# EAGLE design fsr_endstop (EAGLE 6.4)
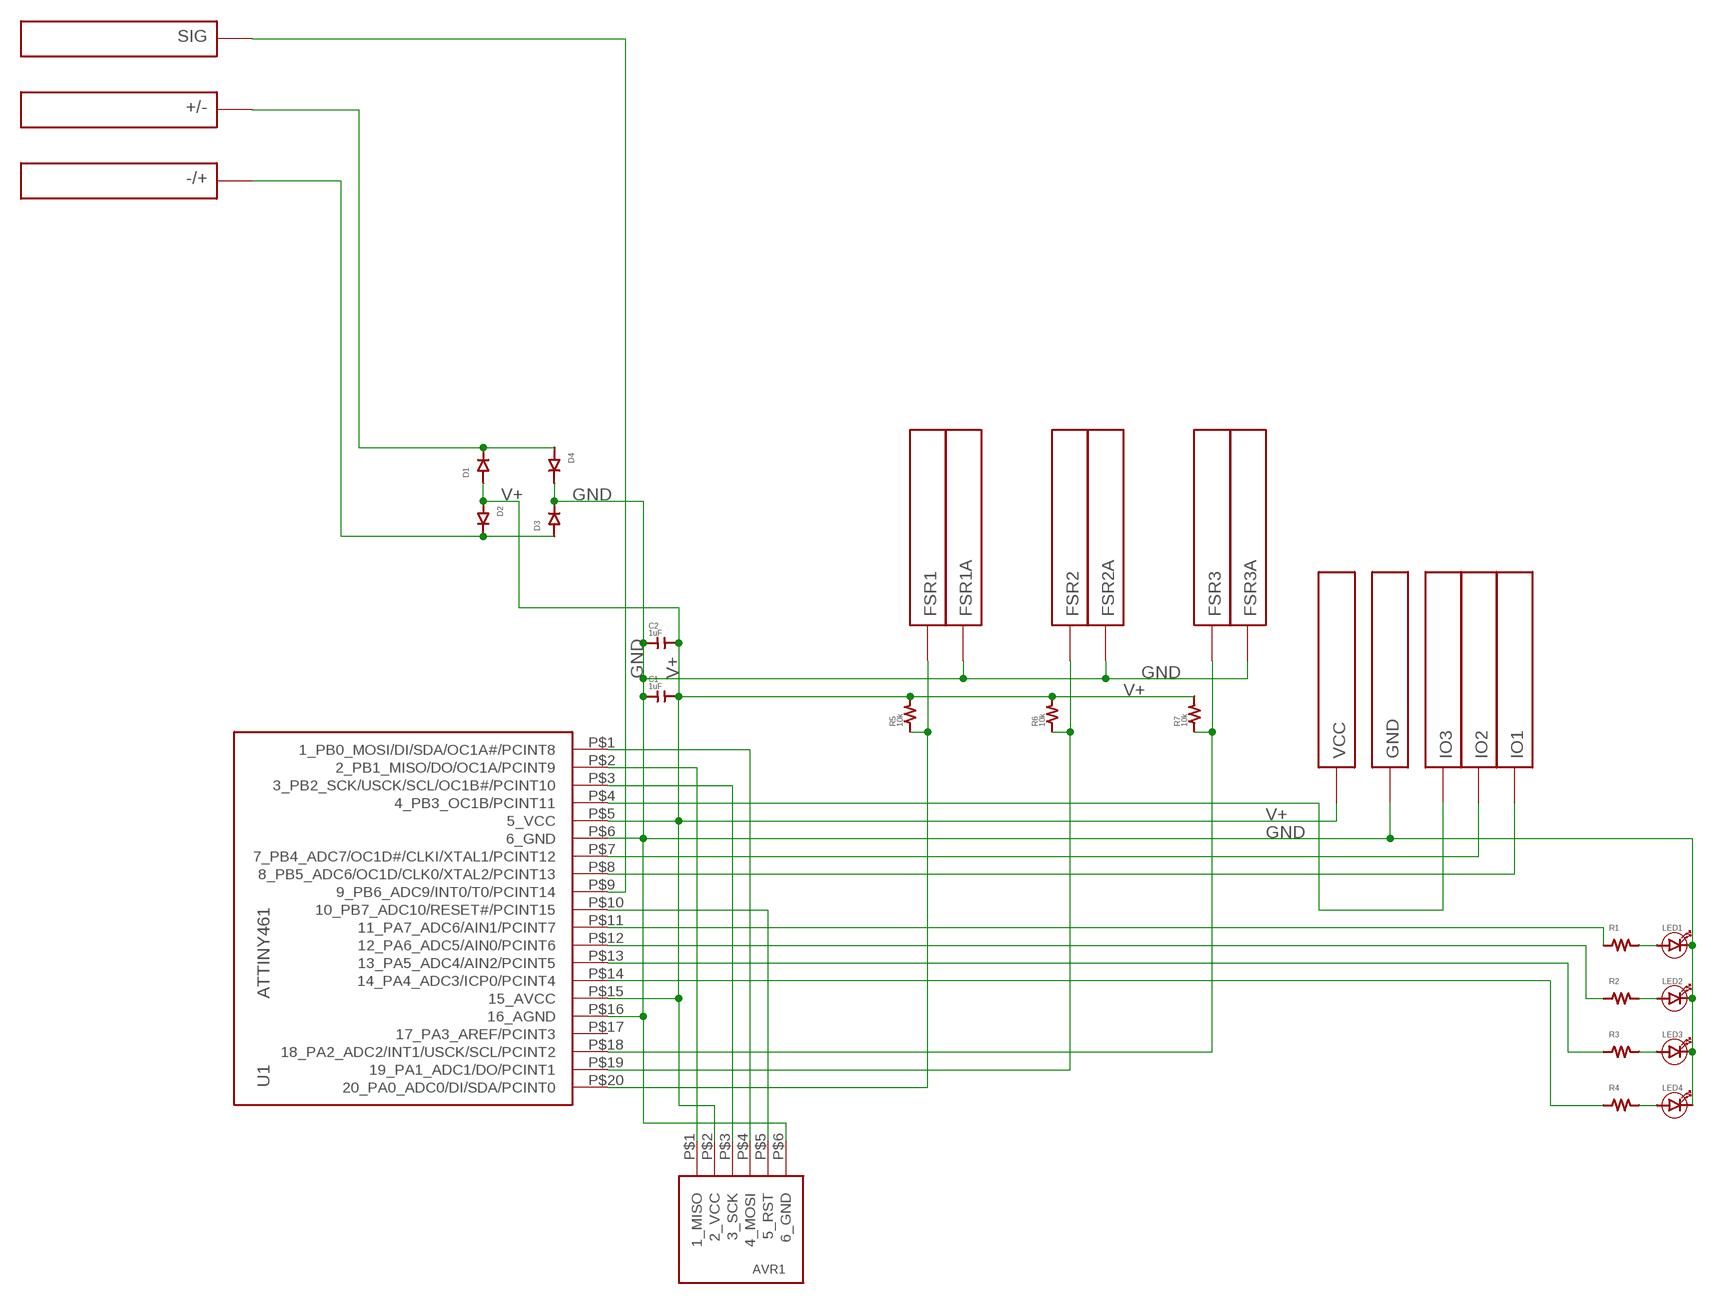
[diagram p0: schematic, sheet 1]

## Parts
+/-  PIN1.2MM  [PIN_1.2MM]
-/+  PIN1.2MM  [PIN_1.2MM]
AVR1  AVR6  [AVR6]
C1  1uF  CAP0603  [0603]
C2  1uF  CAP0603  [0603]
D1  DIODE0603  [0603_DIODE]
D2  DIODE0603  [0603_DIODE]
D3  DIODE0603  [0603_DIODE]
D4  DIODE0603  [0603_DIODE]
FSR1  PIN1.2MM  [PIN_1.2MM]
FSR1A  PIN1.2MM  [PIN_1.2MM]
FSR2  PIN1.2MM  [PIN_1.2MM]
FSR2A  PIN1.2MM  [PIN_1.2MM]
FSR3  PIN1.2MM  [PIN_1.2MM]
FSR3A  PIN1.2MM  [PIN_1.2MM]
GND  PIN1.2MM  [PIN_1.2MM]
IO1  PIN1.2MM  [PIN_1.2MM]
IO2  PIN1.2MM  [PIN_1.2MM]
IO3  PIN1.2MM  [PIN_1.2MM]
LED1  LED0603  [0603_DIODE]
LED2  LED0603  [0603_DIODE]
LED3  LED0603  [0603_DIODE]
LED4  LED0603  [0603_DIODE]
R1  RES0603  [0603]
R2  RES0603  [0603]
R3  RES0603  [0603]
R4  RES0603  [0603]
R5  10k  RES0603  [0603]
R6  10k  RES0603  [0603]
R7  10k  RES0603  [0603]
SIG  PIN1.2MM  [PIN_1.2MM]
U1  ATTINY461  [SOIC-20]
VCC  PIN1.2MM  [PIN_1.2MM]

## Nets
GND: AVR1.P$6(6_GND) C1.1 C2.1 D3.- D4.- FSR1A.P$1 FSR2A.P$1 FSR3A.P$1 GND.P$1 LED1.- LED2.- LED3.- LED4.- U1.P$6(6_GND) U1.P$16(16_AGND)
N$1: AVR1.P$4(4_MOSI) U1.P$1(1_PB0_MOSI/DI/SDA/OC1A#/PCINT8)
N$2: AVR1.P$1(1_MISO) U1.P$2(2_PB1_MISO/DO/OC1A/PCINT9)
N$3: -/+.P$1 D2.- D3.+
N$4: +/-.P$1 D1.- D4.+
N$5: AVR1.P$3(3_SCK) U1.P$3(3_PB2_SCK/USCK/SCL/OC1B#/PCINT10)
N$6: AVR1.P$5(5_RST) U1.P$10(10_PB7_ADC10/RESET#/PCINT15)
N$7: FSR1.P$1 R5.1 U1.P$20(20_PA0_ADC0/DI/SDA/PCINT0)
N$8: FSR2.P$1 R6.1 U1.P$19(19_PA1_ADC1/DO/PCINT1)
N$9: FSR3.P$1 R7.1 U1.P$18(18_PA2_ADC2/INT1/USCK/SCL/PCINT2)
N$10: R4.1 U1.P$14(14_PA4_ADC3/ICP0/PCINT4)
N$11: R3.1 U1.P$13(13_PA5_ADC4/AIN2/PCINT5)
N$12: R2.1 U1.P$12(12_PA6_ADC5/AIN0/PCINT6)
N$13: R1.1 U1.P$11(11_PA7_ADC6/AIN1/PCINT7)
N$14: SIG.P$1 U1.P$9(9_PB6_ADC9/INT0/T0/PCINT14)
N$15: IO3.P$1 U1.P$4(4_PB3_OC1B/PCINT11)
N$16: IO1.P$1 U1.P$8(8_PB5_ADC6/OC1D/CLK0/XTAL2/PCINT13)
N$17: IO2.P$1 U1.P$7(7_PB4_ADC7/OC1D#/CLKI/XTAL1/PCINT12)
N$18: LED1.+ R1.2
N$19: LED2.+ R2.2
N$20: LED3.+ R3.2
N$21: LED4.+ R4.2
V+: AVR1.P$2(2_VCC) C1.2 C2.2 D1.+ D2.+ R5.2 R6.2 R7.2 U1.P$5(5_VCC) U1.P$15(15_AVCC) VCC.P$1
Unconnected: U1.P$17(17_PA3_AREF/PCINT3)

## Library data of the parts
+/- -/+ FSR1 FSR1A FSR2 FSR2A FSR3 FSR3A GND IO1-IO3 SIG VCC = _sg_lib:PIN
AVR1 = _sg_misc:AVR6
C1 C2 = _sg_lib:CAP0603
D1-D4 = _sg_lib:DIODE0603
LED1-LED4 = _sg_lib:LED0603
R1-R7 = _sg_lib:RES0603
U1 = _sg_misc:ATTINY461

## Board
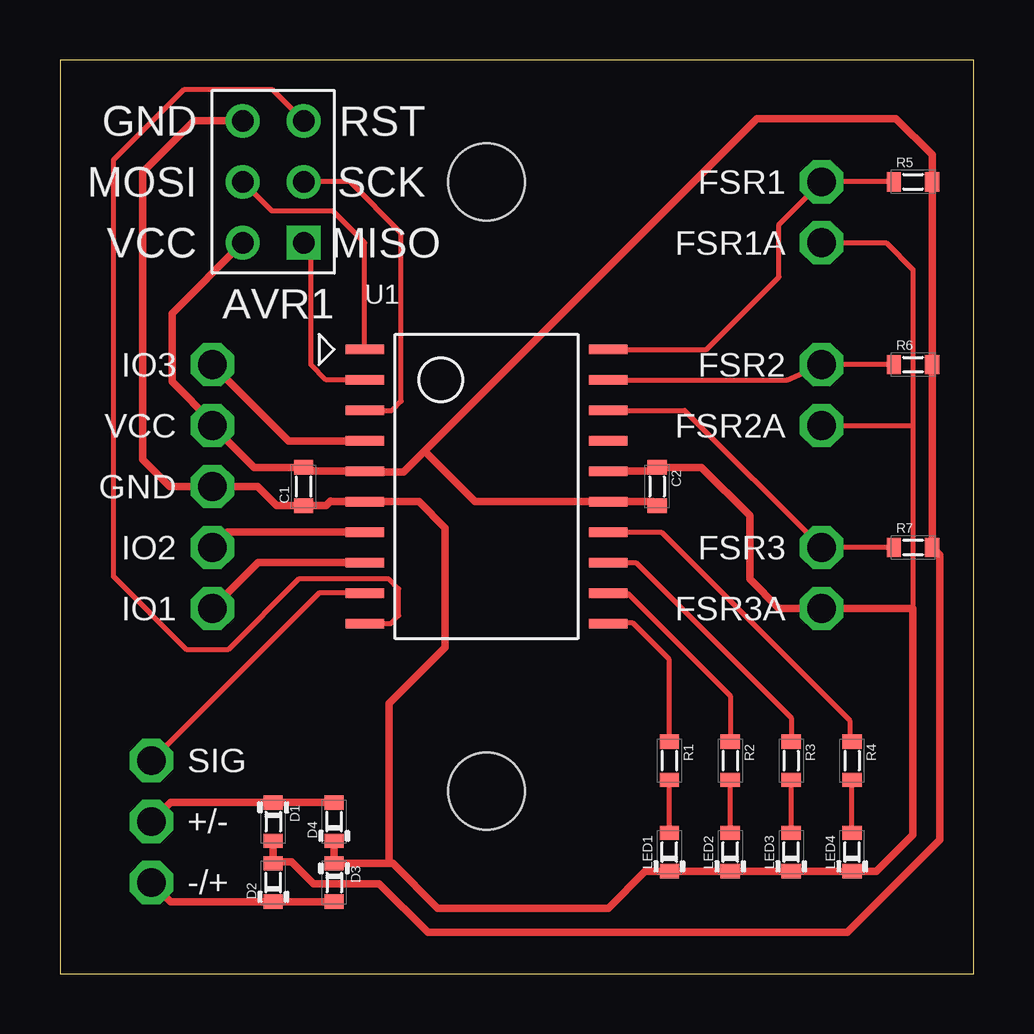
[diagram p1: board, top side]

Size 38.1 x 38.1 mm. Coordinates in mm from the lower left corner, seen from the top.
Outline: 0,0 38.1,0 38.1,38.1 0,38.1 0,0
Copper layers (1*16): Top 0.035mm / dielectric 1.5mm / Bottom 0.035mm
Design rules "default": minimum track width 10mil, minimum drill 24mil, track to track 8mil, track to pad 8mil, pad to pad 8mil, via to via 8mil, smd to smd 8mil, copper to edge 40mil, drill to drill 8mil, minimum pad ring 10mil, minimum via ring 8mil, stop-mask expansion 4mil, vias tented up to drill 0mil, thermal gap 10mil
Holes 3.2 mm at 17.78,33.02 17.78,7.62

### Footprints (pad centres in the part's own frame; a part is rotated, then mirrored left to right if it is on the bottom)
PIN_1.2MM = drill 1.2 octagon: P$1 0,0
AVR6 = drill 0.9 square: P$1 -1.27,2.54 | drill 0.9: P$2 1.27,2.54; P$3 -1.27,0; P$4 1.27,0; P$5 -1.27,-2.54; P$6 1.27,-2.54
0603 = smd 0.6 x 0.8: 1 -0.8,0; 2 0.8,0
0603_DIODE = smd 0.6 x 0.8: + 0.8,0; - -0.8,0
SOIC-20 = smd 1.6 x 0.4: P$1 -5.08,5.715; P$2 -5.08,4.445; P$3 -5.08,3.175; P$4 -5.08,1.905; P$5 -5.08,0.635; P$6 -5.08,-0.635; P$7 -5.08,-1.905; P$8 -5.08,-3.175; P$9 -5.08,-4.445; P$10 -5.08,-5.715; P$11 5.08,-5.715; P$12 5.08,-4.445; P$13 5.08,-3.175; P$14 5.08,-1.905; P$15 5.08,-0.635; P$16 5.08,0.635; P$17 5.08,1.905; P$18 5.08,3.175; P$19 5.08,4.445; P$20 5.08,5.715

### Placement (x,y rotation side)
+/-  3.81,6.35 0 top
-/+  3.81,3.81 0 top
AVR1  8.89,33.02 180 top
C1  10.16,20.32 90 top
C2  24.89,20.32 270 top
D1  8.89,6.35 270 top
D2  8.89,3.81 90 top
D3  11.43,3.81 270 top
D4  11.43,6.35 90 top
FSR1  31.75,33.02 180 top
FSR1A  31.75,30.48 180 top
FSR2  31.75,25.4 180 top
FSR2A  31.75,22.86 180 top
FSR3  31.75,17.78 180 top
FSR3A  31.75,15.24 180 top
GND  6.35,20.32 180 top
IO1  6.35,15.24 180 top
IO2  6.35,17.78 180 top
IO3  6.35,25.4 180 top
LED1  25.4,5.08 90 top
LED2  27.94,5.08 90 top
LED3  30.48,5.08 90 top
LED4  33.02,5.08 90 top
R1  25.4,8.89 270 top
R2  27.94,8.89 270 top
R3  30.48,8.89 270 top
R4  33.02,8.89 270 top
R5  35.56,33.02 0 top
R6  35.56,25.4 0 top
R7  35.56,17.78 0 top
SIG  3.81,8.89 0 top
U1  17.78,20.32 0 top
VCC  6.35,22.86 180 top

### Tracks (layer width: path | path; a pad name or v marks a point on that pad's centre or on a via)
GND
  Top 0.203: FSR1A.P$1 34.44,30.48 35.56,29.36 35.56,22.86 | 35.56,22.86 35.56,15.24 | 33.03,4.27 LED4.- | FSR2A.P$1 35.56,22.86
  Top 0.305: D4.- D3.- 13.61,4.61 | 13.61,4.61 13.88,4.61 15.75,2.74 22.86,2.74 24.38,4.27 25.39,4.27 LED1.- LED2.- LED3.- LED4.- | 33.03,4.27 34.04,4.27 35.56,5.79 35.56,15.24 FSR3A.P$1 29.97,15.24 28.75,16.46 28.75,19.1 26.73,21.12 C2.1 24.73,20.96 U1.P$16 | AVR1.P$6 5.59,35.56 3.45,33.43 3.45,21.44 4.57,20.32 GND.P$1 8.23,20.32 9.03,19.52 C1.1 11.09,19.52 11.28,19.71 11.3,19.68 U1.P$6 14.96,19.68 16.05,18.59 16.05,13.61 13.72,11.28 13.72,4.71 13.61,4.61
N$1
  Top 0.203: U1.P$1 12.7,30.48 11.38,31.8 8.84,31.8 AVR1.P$4
N$2
  Top 0.203: U1.P$2 11.1,24.77 10.46,25.4 10.46,30.18 AVR1.P$1
N$3
  Top 0.305: D3.+ D2.- 4.61,3.01 -/+.P$1
N$4
  Top 0.305: D4.+ D1.- 4.61,7.15 +/-.P$1
N$5
  Top 0.203: U1.P$3 13.84,23.5 14.22,23.88 14.22,30.89 12.09,33.02 AVR1.P$3
N$6
  Top 0.203: U1.P$10 13.79,14.61 14.12,14.94 14.12,16.05 13.72,16.46 9.96,16.46 7.01,13.51 5.28,13.51 2.24,16.56 2.24,33.93 5.18,36.88 8.84,36.88 AVR1.P$5
N$7
  Top 0.203: R5.1 FSR1.P$1 29.97,31.24 29.97,29.06 26.95,26.04 U1.P$20
N$8
  Top 0.203: R6.1 FSR2.P$1 30.3,24.77 U1.P$19
N$9
  Top 0.203: R7.1 FSR3.P$1 26.04,23.5 U1.P$18
N$10
  Top 0.203: U1.P$14 25.07,18.41 32.92,10.57 32.92,9.79 R4.1
N$11
  Top 0.203: U1.P$13 24,17.14 30.48,10.67 R3.1
N$12
  Top 0.203: U1.P$12 23.65,15.88 27.94,11.58 R2.1
N$13
  Top 0.203: R1.1 25.4,13.11 23.88,14.63 22.89,14.63 U1.P$11
N$14
  Top 0.203: U1.P$9 10.8,15.88 SIG.P$1
N$15
  Top 0.305: U1.P$4 9.53,22.22 IO3.P$1
N$16
  Top 0.305: U1.P$8 8.25,17.14 IO1.P$1
N$17
  Top 0.305: U1.P$7 6.98,18.41 IO2.P$1
N$18
  Top 0.203: LED1.+ R1.2
N$19
  Top 0.203: LED2.+ R2.2
N$20
  Top 0.203: LED3.+ R3.2
N$21
  Top 0.203: LED4.+ R4.2
V+
  Top 0.305: D2.+ D1.+ 8.89,4.72 8.84,4.67 9.65,4.67 10.57,3.76 13.31,3.76 15.34,1.73 32.82,1.73 36.68,5.59 36.68,17.46 R7.2 R6.2 R5.2 36.36,34.15 34.85,35.66 29.06,35.66 15.19,21.79 | AVR1.P$2 4.67,27.53 4.67,24.69 6.35,23.01 VCC.P$1 8.09,21.12 C1.2 10.32,20.96 U1.P$5 12.73,20.93 14.33,20.93 15.19,21.79 | C2.2 24.73,19.68 U1.P$15 17.3,19.68 15.19,21.79